# Altium schematic sheet afficheur.SchDoc
size A4; SheetNumber: 5; SheetTotal: 7
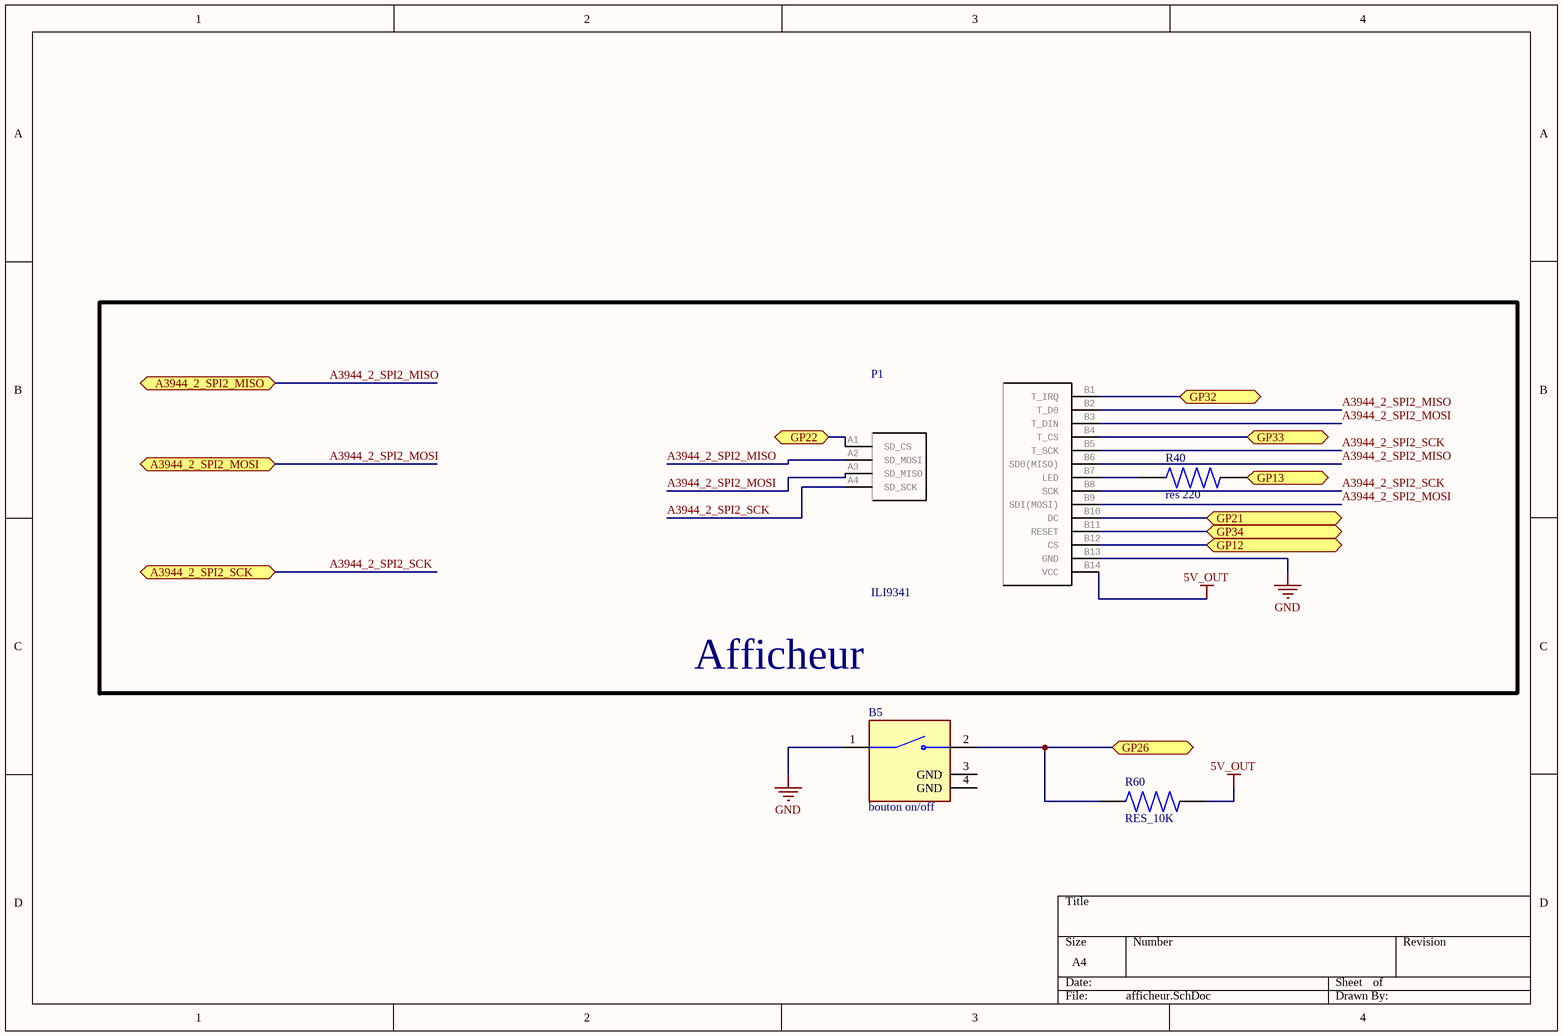
[diagram p0: afficheur.SchDoc]

## Parts
B5  bouton on/off  [button]
P1  ILI9341  [ILI9341]
R40  res 220  [res 220]
R60  RES_10K  [RES_10k]

## Blocks framed on the sheet
Afficheur: P1 R40

## Ports
A3944_2_SPI2_MISO (bidir), A3944_2_SPI2_MOSI (bidir), A3944_2_SPI2_SCK (bidir), GP12 (bidir), GP13 (bidir), GP21 (bidir), GP22 (bidir), GP26 (bidir), GP32 (bidir), GP33 (bidir), GP34 (bidir)

## Nets
5V_OUT: P1.B14(VCC) R60.2
GND: B5.1(COM) P1.B13(GND)
A3944_2_SPI2_MISO: P1.A2(SD_MOSI) P1.B2(T_D0) P1.B6(SD0(MISO)) ; port A3944_2_SPI2_MISO
A3944_2_SPI2_MOSI: P1.A3(SD_MISO) P1.B3(T_DIN) P1.B9(SDI(MOSI)) ; port A3944_2_SPI2_MOSI
A3944_2_SPI2_SCK: P1.A4(SD_SCK) P1.B5(T_SCK) P1.B8(SCK) ; port A3944_2_SPI2_SCK
GP12: P1.B12(CS) ; port GP12
GP13: R40.2 ; port GP13
GP21: P1.B10(DC) ; port GP21
GP22: P1.A1(SD_CS) ; port GP22
GP26: B5.2(NO) R60.1 ; port GP26
GP32: P1.B1(T_IRQ) ; port GP32
GP33: P1.B4(T_CS) ; port GP33
GP34: P1.B11(RESET) ; port GP34
NetP1_B7: P1.B7(LED) R40.1

Not connected (* = marked no-connect by the designer): B5 3(GND) 4(GND)

## Library data of the parts
B5 = bouton reset: Mfr: CUI Devices; Mfr réf: TS11-674-120-BK-260-RA-D; Supplier: DigiKey; Supplier réf: 2223-TS11-674-120-BK-260-RA-D-ND
R60 = RES_10K: Thick Film Resistors - SMD ResHighPowerA 0805 10k 1% 1/2W TC100; Mfr: Bourns Inc.; Mfr réf: CMP0805AFX-1002ELF; Supplier: Mouser; Supplier réf: 652-CMP0805AFX-1002L; Footprint: R0805